# Altium schematic sheet CS1238-24-Bit-ADC.SchDoc: CS1238 24Bit ADC Module
size 250 x 160 mm; Date: 12/06/2024; DrawnBy: Yasir Shahzad; Organization: Mastermind; Revision: 1.0; SheetNumber: 1; SheetTotal: 1
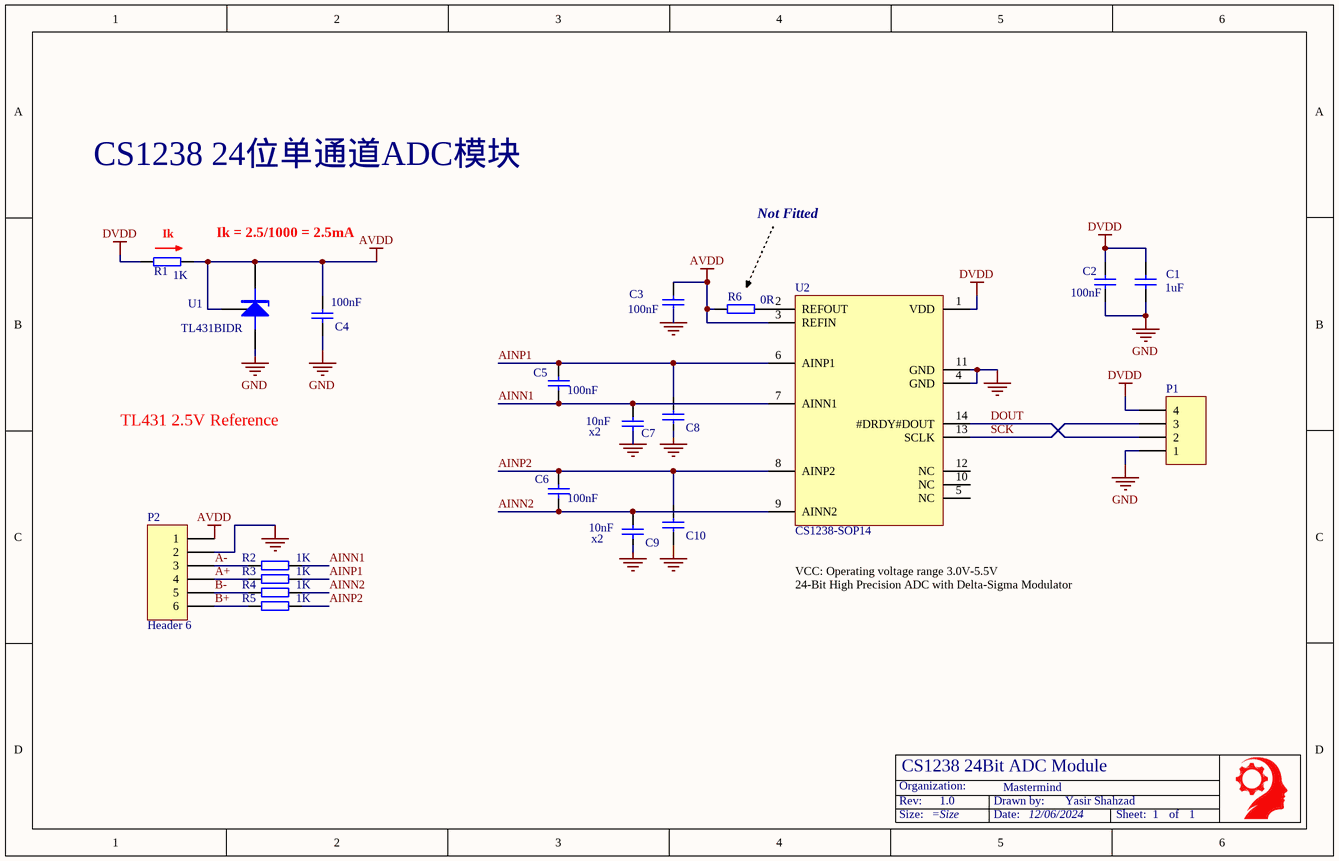
[diagram p0: CS1238-24-Bit-ADC.SchDoc]

## Parts
*  TitleBlock  (value not drawn)  (graphical)
C1  1uF  [C0603]  (value not drawn)
C2  100nF  [C0603]  (value not drawn)
C3  100nF  [C0603]  (value not drawn)
C4  100nF  [C0603]  (value not drawn)
C5  100nF  [C0603]  (value not drawn)
C6  100nF  [C0603]  (value not drawn)
C7  10nF  [C0603]  (value not drawn)
C8  10nF  [C0603]  (value not drawn)
C9  10nF  [C0603]  (value not drawn)
C10  10nF  [C0603]  (value not drawn)
P1  (no value)  [HDR1X4]
P2  Header 6  [HDR1X6]
R1  1kΩ  [R0603]  (value not drawn)
R2  1kΩ  [R0603]  (value not drawn)
R3  1kΩ  [R0603]  (value not drawn)
R4  1kΩ  [R0603]  (value not drawn)
R5  1kΩ  [R0603]  (value not drawn)
R6  0Ω  [R0603]  (value not drawn)
U1  TL431BIDR  [SOIC-8E]
U2  CS1238-SOP14  [SOP-14_L8.6-W3.9-P1.27-LS6.0-BL]

## Nets
AVDD: C3.1 C4.1 P2.1 R1.1 R6.1 U1.1(K) U1.8(Ref) U2.3(REFIN)
DVDD: C1.1 C2.1 P1.4 R1.2 U2.1(VDD)
GND: C1.2 C2.2 C3.2 C4.2 C7.1 C8.2 C9.1 C10.1 P1.1 P2.2 U1.3(A) U2.4(GND) U2.11(GND)
A+: P2.4 R3.2
A-: P2.3 R2.2
AINN1: C5.1 C7.2 R2.1 U2.7(AINN1)
AINN2: C6.2 C9.2 R4.1 U2.9(AINN2)
AINP1: C5.2 C8.1 R3.1 U2.6(AINP1)
AINP2: C6.1 C10.2 R5.1 U2.8(AINP2)
B+: P2.6 R5.2
B-: P2.5 R4.2
DOUT: P1.2 U2.14(#DRDY#DOUT)
SCK: P1.3 U2.13(SCLK)
NetR6_2: R6.2 U2.2(REFOUT)

Not connected (* = marked no-connect by the designer): U1 4(NC) 5(NC); U2 5(NC) 10(NC) 12(NC)

## Notes on the sheet
- CS1238 24位单通道ADC模块
- (near R1) Ik
- Ik = 2.5/1000 = 2.5mA
- Not Fitted
- (near R1) 1K
- (near C4) 100nF
- (near C3) 100nF
- (near R6) 0R
- (near C2) 100nF
- (near C1) 1uF
- (near C5) 100nF
- TL431 2.5V Reference
- 10nF
- x2
- (near C6) 100nF
- (near C9) 10nF
- 1K
- (near R2) 1K
- VCC: Operating voltage range 3.0V-5.5V
- 24-Bit High Precision ADC with Delta-Sigma Modulator
- (in symbol TitleBlock) Organization:; Rev:; Drawn by:; Size:; Date:; Sheet:; of

## Library data of the parts
* = TitleBlock: Title Block for Schematic Sheets
C1-C10 = Cap_0603: Capacitor, X5R, ±10%, 6.3V; Part Number: C0603-N.C.; Manufacturer: N.A.; Artikkelnr Noca: 20069060; Datasheet: *; LatestRevisionDate: 2009-11-23; Pin Count: 2; Publisher: Nordic Semiconductor; Published: 2009-05-08; Volts: 6.3V; Supplier: *; Supplier part number: *; 2nd source Supplier: *; 2nd source part number: *; Footprint Doc: 0603; Artikkelnr Simpro: N.A.; Manufacturer Part Number: N.A.
  C1: Value: 1uF
  C2-C6: Value: 100nF
  C7-C10: Value: 10nF
P1 = Header 4: Header, 4-Pin; LatestRevisionDate: 17-Jul-2002; LatestRevisionNote: Re-released for DXP Platform.; Publisher: Altium Limited
P2 = Header 6: Header, 6-Pin; LatestRevisionDate: 17-Jul-2002; LatestRevisionNote: Re-released for DXP Platform.; Publisher: Altium Limited
R1-R6 = Res_0603: Resistor, ±1%, 0.100W; Part Number: R0603-N.C.Ω; Manufacturer: N.A.; Note: Chip Res; Manufacturer Part Number: N.A.; Datasheet: *; Footprint Doc: 0603; LatestRevisionDate: 2009-05-08; Pin Count: 2; Publisher: Nordic Semiconductor; Published: 2009-05-08; Supplier: *; Supplier part number: *; 2nd source Supplier: *; 2nd source part number: *; Artikkelnr Noca: N.A.; Artikkelnr Simpro: N.A.
  R1-R5: Value: 1kΩ
  R6: Value: 0Ω
U1 = TL431BIDR: TL431, TL432 Precision Programmable Reference; pin to pad: 3>2+3+6+7; Manufacturer: TI(德州仪器); Add into BOM: yes; Output Type: Adjustable; Output Voltage: 2.495V~36V; Output Current: 100mA; Tolerance: ±0.5%; Reference Type: parallel connection; Minimum Cathode Current for Regulation: 700uA; Symbol: TL431BIDR; Device: TL431BIDR; LCSC Part Name: TL431BIDR; Supplier Part: C366884; Manufacturer Part: TL431BIDR; Supplier Footprint: SOIC-8; JLCPCB Part Class: Extended Part; Datasheet: https://www.ti.com/cn/lit/gpn/tl431; Supplier: LCSC; Convert to PCB: yes; Input Voltage: -; Temperature Coefficient: -; Supply Current: -; Noise - 1/10Hz to 10Hz: -; Noise - 10Hz to 10kHz: -; Operating Temperature: -40℃~+85℃@(Ta)
U2 = CS1238-SOP14: Manufacturer: CHIPSEA(芯海科技); Symbol: CS1238; Add into BOM: yes; Device: CS1238-SOP14; LCSC Part Name: CS1238-SO; Supplier Part: C81829; Manufacturer Part: CS1238-SOP14; Supplier Footprint: SOP-14; JLCPCB Part Class: Extended Part; Datasheet: https://atta.szlcsc.com/upload/public/pdf/source/20160919/1474265371144.pdf; Supplier: LCSC; Convert to PCB: yes